# EAGLE schematic Dashboard rev0.1 (EAGLE 7.7.0)
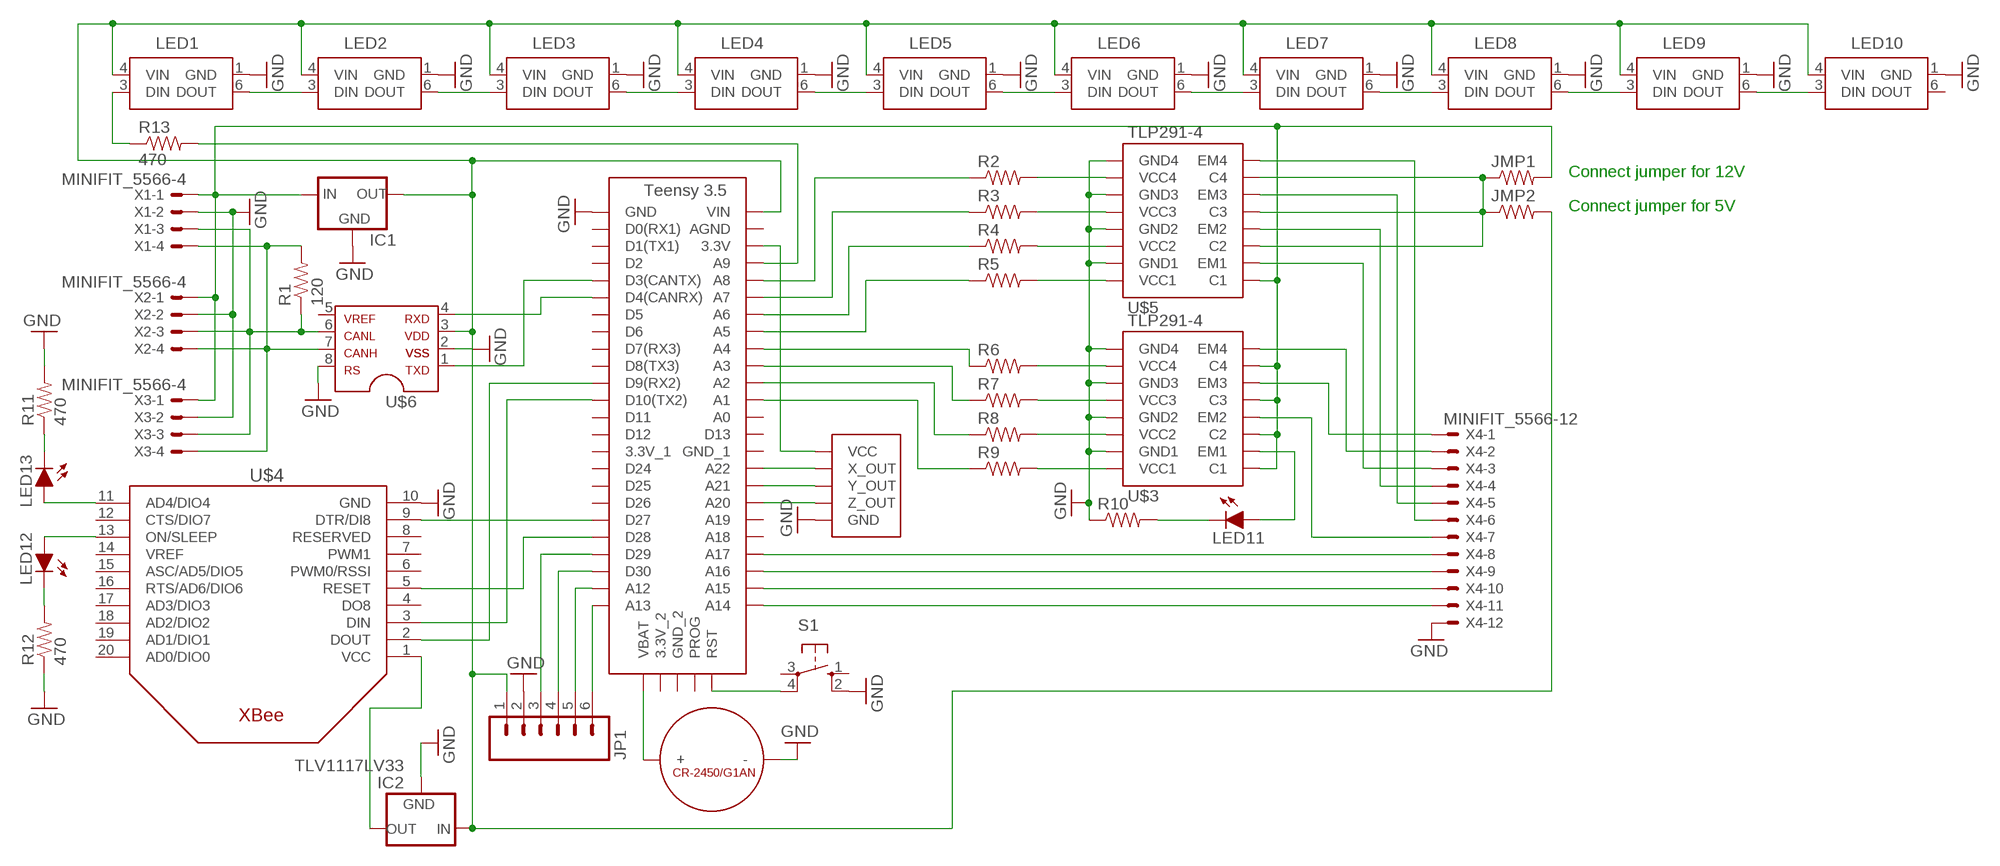
[diagram p0: schematic, sheet 1]

## Parts
IC1  5VREG_L7805_HOR  [TO-220-H]
IC2  TLV1117LV33  [SOT223]
JMP1  RESISTORPTH-1/4W-VERT  [AXIAL-0.1]
JMP2  RESISTORPTH-1/4W-VERT  [AXIAL-0.1]
JP1  M06  [1X06]
LED1  WS2812B5050  [RGBLED5050]
LED2  WS2812B5050  [RGBLED5050]
LED3  WS2812B5050  [RGBLED5050]
LED4  WS2812B5050  [RGBLED5050]
LED5  WS2812B5050  [RGBLED5050]
LED6  WS2812B5050  [RGBLED5050]
LED7  WS2812B5050  [RGBLED5050]
LED8  WS2812B5050  [RGBLED5050]
LED9  WS2812B5050  [RGBLED5050]
LED10  WS2812B5050  [RGBLED5050]
LED11  LED-0805  [LED-805]
LED12  LED-0805  [LED-805]
LED13  LED-0805  [LED-805]
R1  120  RESISTOR0805-RES  [0805]
R2  RESISTOR0805-RES  [0805]
R3  RESISTOR0805-RES  [0805]
R4  RESISTOR0805-RES  [0805]
R5  RESISTOR0805-RES  [0805]
R6  RESISTOR0805-RES  [0805]
R7  RESISTOR0805-RES  [0805]
R8  RESISTOR0805-RES  [0805]
R9  RESISTOR0805-RES  [0805]
R10  RESISTOR0805-RES  [0805]
R11  470  RESISTOR0805-RES  [0805]
R12  470  RESISTOR0805-RES  [0805]
R13  470  RESISTOR0805-RES  [0805]
S1  BTN_10-XX  [B3F-10XX]
U$1  TEENSY_3.5_SIMPLE_RTC  [TEENSY_3.5_SIMPLE_RTC]
U$2  CR-2450/G1AN  [CR-2450/G1AN]
U$3  TLP291-4  [SOIC-16]
U$4  XBEE  [XBEE]
U$5  TLP291-4  [SOIC-16]
U$6  MCP2551  [SOIC-08]
U$7  ADXL335  [ADXL335]
X1  MINIFIT_5566-4  [MINIFIT_5566-4]
X2  MINIFIT_5566-4  [MINIFIT_5566-4]
X3  MINIFIT_5566-4  [MINIFIT_5566-4]
X4  MINIFIT_5566-12  [MINIFIT_5566-12]

## Nets
GND: IC1.2(GND) IC2.1(GND) JP1.2 LED1.1(GND) LED2.1(GND) LED3.1(GND) LED4.1(GND) LED5.1(GND) LED6.1(GND) LED7.1(GND) LED8.1(GND) LED9.1(GND) LED10.1(GND) R10.1 R11.2 R12.1 S1.2(S1) U$1.GND U$2.- U$3.2(GND1) U$3.4(GND2) U$3.6(GND3) U$3.8(GND4) U$4.10(GND) U$5.2(GND1) U$5.4(GND2) U$5.6(GND3) U$5.8(GND4) U$6.2 U$6.8 U$7.GND X1.2 X2.2 X3.2 X4.12
N$1: U$1.VBAT U$2.+_0(+) U$2.+_1(+)
N$2: R2.2 U$5.7(VCC4)
N$3: LED1.6(DOUT) LED2.3(DIN)
N$4: LED2.6(DOUT) LED3.3(DIN)
N$5: LED3.6(DOUT) LED4.3(DIN)
N$6: LED4.6(DOUT) LED5.3(DIN)
N$7: LED5.6(DOUT) LED6.3(DIN)
N$8: LED6.6(DOUT) LED7.3(DIN)
N$9: LED7.6(DOUT) LED8.3(DIN)
N$10: LED8.6(DOUT) LED9.3(DIN)
N$11: LED9.6(DOUT) LED10.3(DIN)
N$12: R3.2 U$5.5(VCC3)
N$13: U$1.D3(CANTX) U$6.1
N$14: IC1.1(IN) JMP1.P$2 U$3.10(C4) U$3.12(C3) U$3.14(C2) U$3.16(C1) U$5.16(C1) X1.1 X2.1 X3.1
N$15: U$1.D4(CANRX) U$6.4
N$16: R1.1 U$6.6 X1.3 X2.3 X3.3
N$17: R1.2 U$6.7 X1.4 X2.4 X3.4
N$18: LED12.A U$4.13(ON/SLEEP)
N$19: R13.2 U$1.A9
N$20: R2.1 U$1.A8
N$21: R3.1 U$1.A7
N$22: R4.1 U$1.A6
N$23: R5.1 U$1.A5
N$24: R6.1 U$1.A4
N$25: R7.1 U$1.A3
N$26: R8.1 U$1.A2
N$27: R9.1 U$1.A1
N$28: R4.2 U$5.3(VCC2)
N$29: R5.2 U$5.1(VCC1)
N$30: R6.2 U$3.7(VCC4)
N$31: R7.2 U$3.5(VCC3)
N$32: R8.2 U$3.3(VCC2)
N$33: R9.2 U$3.1(VCC1)
N$35: JMP1.P$1 JMP2.P$1 U$5.10(C4) U$5.12(C3) U$5.14(C2)
N$36: U$1.3.3V U$7.VCC
N$37: U$1.A22 U$7.X_OUT
N$38: U$1.A21 U$7.Y_OUT
N$39: U$1.A20 U$7.Z_OUT
N$40: S1.4(P1) U$1.RST
N$41: U$1.D28 U$4.5(RESET)
N$42: U$1.A14 X4.11
N$43: U$1.A16 X4.9
N$44: U$5.9(EM4) X4.6
N$45: U$5.11(EM3) X4.5
N$46: U$5.13(EM2) X4.4
N$47: U$5.15(EM1) X4.3
N$48: U$3.9(EM4) X4.2
N$49: U$3.11(EM3) X4.1
N$50: U$3.13(EM2) X4.7
N$51: LED11.A U$3.15(EM1)
N$52: U$1.A17 X4.8
N$53: U$1.A15 X4.10
N$54: U$1.D9(RX2) U$4.2(DOUT)
N$55: U$1.D10(TX2) U$4.3(DIN)
N$56: U$1.D27 U$4.9(DTR/DI8)
N$57: LED11.C R10.2
N$58: LED13.A U$4.11(AD4/DIO4)
N$59: LED13.C R11.1
N$60: LED12.C R12.2
N$61: IC1.3(OUT) IC2.3(IN) JMP2.P$2 JP1.1 LED1.4(VIN) LED2.4(VIN) LED3.4(VIN) LED4.4(VIN) LED5.4(VIN) LED6.4(VIN) LED7.4(VIN) LED8.4(VIN) LED9.4(VIN) LED10.4(VIN) U$1.VIN U$6.3
N$62: JP1.5 U$1.A12
N$63: JP1.4 U$1.D30
N$64: JP1.3 U$1.D29
N$65: JP1.6 U$1.A13
N$66: LED1.3(DIN) R13.1
VCC: IC2.2(OUT) IC2.4(OUT) U$4.1(VCC)
Unconnected: LED10.6(DOUT) S1.1(S) S1.3(P) U$1.3.3V_1 U$1.3.3V_2 U$1.A0 U$1.A18 U$1.A19 U$1.AGND U$1.D0(RX1) U$1.D1(TX1) U$1.D2 U$1.D5 U$1.D6 U$1.D7(RX3) U$1.D8(TX3) U$1.D11 U$1.D12 U$1.D13 U$1.D24 U$1.D25 U$1.D26 U$1.GND_1 U$1.GND_2 U$1.PROG U$4.4(DO8) U$4.6(PWM0/RSSI) U$4.7(PWM1) U$4.8(RESERVED) U$4.12(CTS/DIO7) U$4.14(VREF) U$4.15(ASC/AD5/DIO5) U$4.16(RTS/AD6/DIO6) U$4.17(AD3/DIO3) U$4.18(AD2/DIO2) U$4.19(AD1/DIO1) U$4.20(AD0/DIO0) U$6.5

## Notes on the sheet
- Connect jumper for 12V
- Connect jumper for 5V

## Library data of the parts
IC1 = HyTechDevices:5VREG_L7805: Voltage Regulator Switching 5v regulator Datasheet <http://power.murata.com/data/power/oki-78sr.pdf> Standard 7805 5V regulator. IGO (Input Ground Output). Spark Fun Electronics SKU : COM-00107 Datasheet <http://www.mouser.com/ds/2/308/MC7800-D-94905.pdf>
IC2 = HyTechDevices:TLV1117LV33: Texas Instruments TLV1117LV33 3.3V Linear Regulator
JMP1 JMP2 R1-R13 = HyTechDevices:RESISTOR: Resistor Basic schematic elements and footprints for 0603, 1206, and PTH resistors.
JP1 = HyTechDevices:M06: Standard 6-pin 0.1" header. NOTES ON THE VARIANTS LOCK and LOCK_LONGPADS... This footprint was designed to help hold the alignment of a through-hole component (i.e. 6-pin header) while soldering it into place. You may notice that each hole has been shifted either up or down by 0.005 of an inch from it's more standard position (which is a perfectly straight line). This slight alteration caused the pins (the squares in the middle) to touch the edges of the holes. Because they are alternating, it causes a "brace" to hold the component in place. 0.005 has proven to be the perfect amount of "off-center" position when using our standard breakaway headers. Although looks a little odd when you look at the bare footprint, once you have a header in there, the alteration is very hard to notice. Also,if you push a header all the way into place, it is covered up entirely on the bottom side. This idea of altering the position of holes to aid alignment will be further integrated into the Sparkfun Library for other footprints. It can help hold any component with 3 or more connection pins. Note: The Sparkfun version includes many other packages including surface mount that may be of future interest. Source: Sparkfun <https://github.com/sparkfun/SparkFun-Eagle-Libraries>
LED1-LED10 = HyTechDevices:WS2812B: 4 Pin RBG LED individually addressable. Source: Adafruit
LED11-LED13 = HyTechDevices:LED: Light Emitting Diode (LED) Source: Dangerous Prototypes Eagle Library <https://github.com/DangerousPrototypes/Eagle_Part_Library>
S1 = HyTechDevices:BTN_10-XX: OMRON SWITCH; MPN: B3F-1000; OC_FARNELL: 176432; OC_NEWARK: 36M3542
U$1 = HyTechDevices:TEENSY_3.5_SIMPLE_RTC: Simple version of the Teensy 3.5 board that only uses the 2 main rows of pins, plus the perpendicular row with VBat.
U$2 = HyTechDevices:CR-2450/G1AN: Panasonic CR2450 Battery through hole.
U$3 U$5 = HyTechDevices:TLP291-4: Toshiba Quad Channel Optocoupler TLP291-4
U$4 = HyTechDevices:XBEE: Source: Adafruit <https://github.com/adafruit/Adafruit-Eagle-Library>
U$6 = HyTechDevices:MCP2551: MCP2551 High-Speed CAN Transceiver Product Webpage <https://www.microchip.com/wwwproducts/en/MCP2551> Datasheet <http://ww1.microchip.com/downloads/en/DeviceDoc/21667f.pdf> This device is outdated It is replaced by MCP2561. Comparison Page <https://www.microchip.com/wwwproducts/ProductCompare/MCP2551/MCP2561> Product Webpage <https://www.microchip.com/wwwproducts/en/MCP2561> Datasheet <http://ww1.microchip.com/downloads/en/DeviceDoc/20005167C.pdf>
U$7 = HyTechDevices:ADXL335: ADXL335 3-axis accelerometer breakout board
X1-X3 = HyTechDevices:MINIFIT_5566-4: Mini-Fit Junior connector 4 pole Source: http://www.molex.com; OC_FARNELL: unknown; OC_NEWARK: unknown
X4 = HyTechDevices:MINIFIT_5566-12: Mini-Fit Junior connector 12 pole Source: http://www.molex.com; OC_FARNELL: unknown; OC_NEWARK: unknown